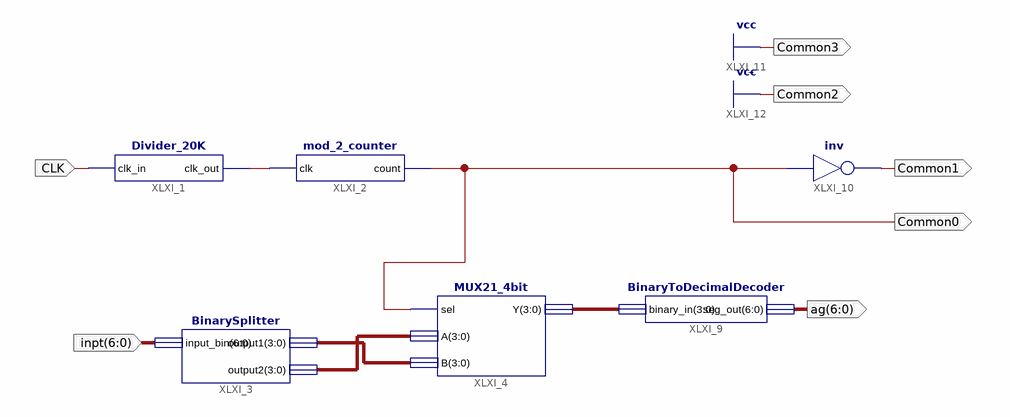
[diagram p0: schematic sheet 1]
// Xilinx ISE schematic TopLayer.sch (spartan6) as structural Verilog: 6 symbols, 7 ports
module TopLayer (
  input  CLK,
  input  [6:0] inpt,
  output Common0,
  output [6:0] ag,
  output Common1,
  output Common3,
  output Common2
);

  wire XLXN_1;
  wire [3:0] XLXN_6, XLXN_7, XLXN_17;

  Divider_20K XLXI_1 (.clk_in(CLK), .clk_out(XLXN_1));
  mod_2_counter XLXI_2 (.clk(XLXN_1), .count(Common0));
  MUX21_4bit XLXI_4 (.sel(Common0), .A(XLXN_7), .B(XLXN_6), .Y(XLXN_17));
  BinarySplitter XLXI_3 (.input_bin(inpt), .output1(XLXN_6), .output2(XLXN_7));
  BinaryToDecimalDecoder XLXI_9 (.binary_in(XLXN_17), .seg_out(ag));
  not XLXI_10 (Common1, Common0);

  assign Common2 = 1'b1;
  assign Common3 = 1'b1;
endmodule
